# Altium schematic sheet Klok.SchDoc
size A4
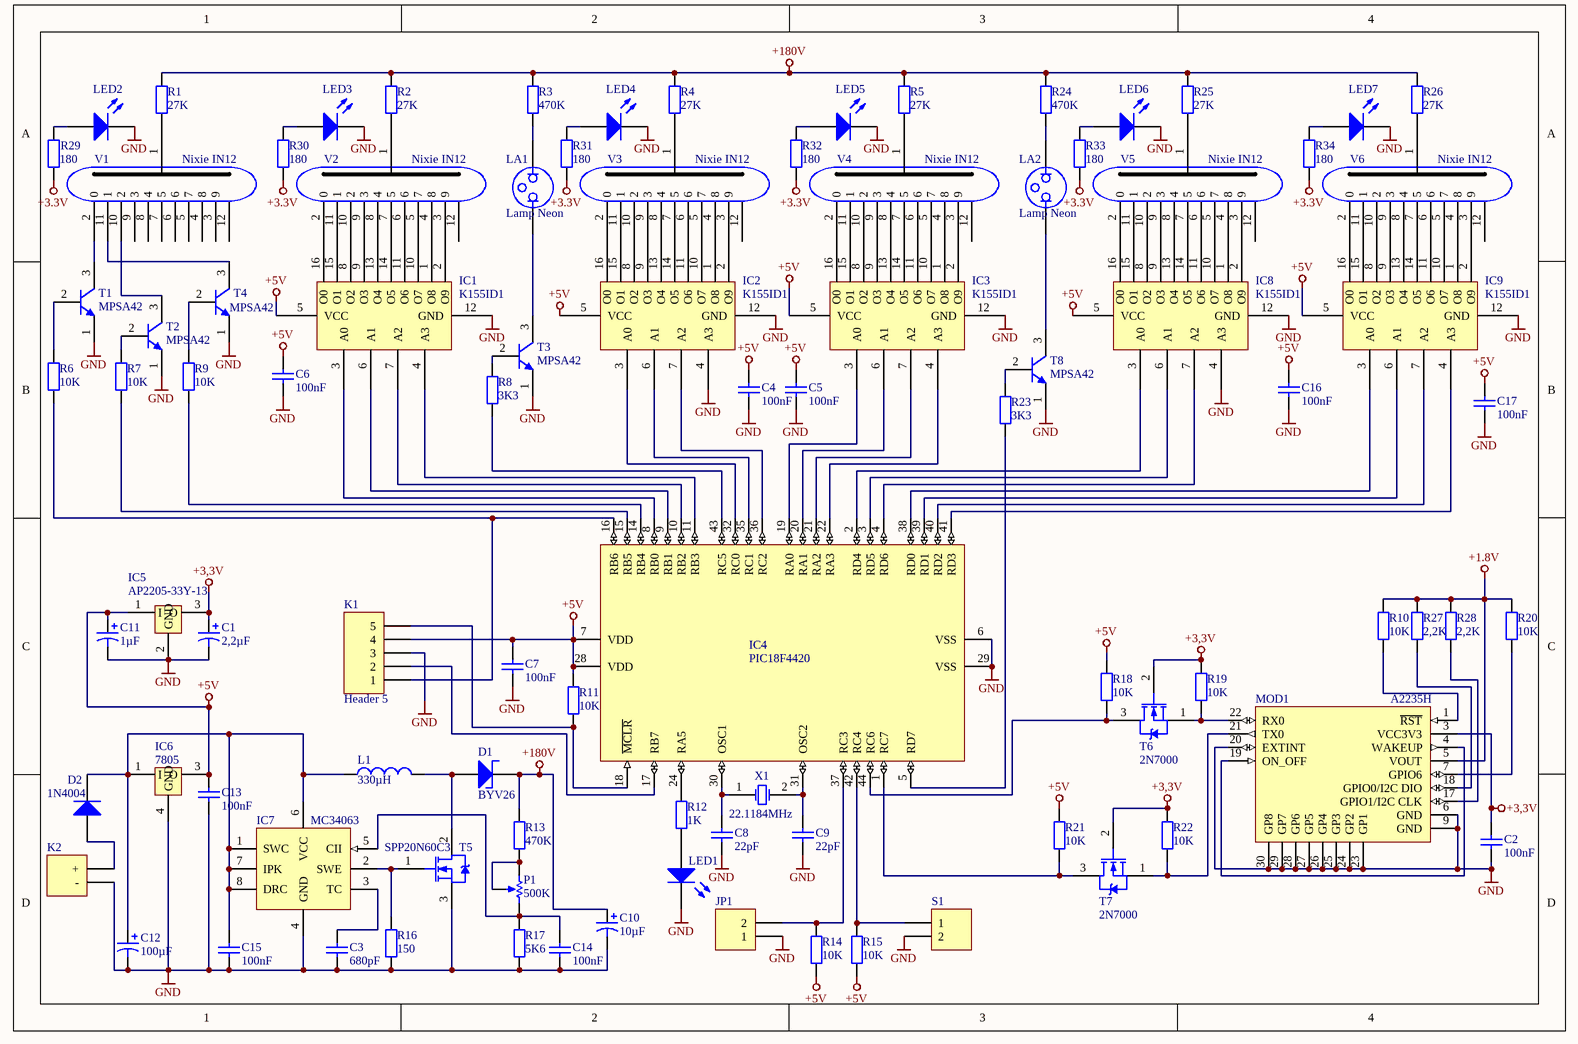
[diagram p0: Klok.SchDoc]

## Parts
C1  value 2,2µF  [ELCO2.2]  (hidden comment: Cap Pol1)
C2  value 100nF  [1206_Capacitor]  (hidden comment: Cap)
C3  value 680pF  [1206_Capacitor]  (hidden comment: Cap)
C4  value 100nF  [1206_Capacitor]  (hidden comment: Cap)
C5  value 100nF  [1206_Capacitor]  (hidden comment: Cap)
C6  value 100nF  [1206_Capacitor]  (hidden comment: Cap)
C7  value 100nF  [1206_Capacitor]  (hidden comment: Cap)
C8  value 22pF  [1206_Capacitor]  (hidden comment: Cap)
C9  value 22pF  [1206_Capacitor]  (hidden comment: Cap)
C10  value 10µF  [ELCO10]  (hidden comment: Cap Pol1)
C11  value 1µF  [ELCO100]  (hidden comment: Cap Pol1)
C12  value 100µF  [ELCO100]  (hidden comment: Cap Pol1)
C13  value 100nF  [1206_Capacitor]  (hidden comment: Cap)
C14  value 100nF  [1206_Capacitor]  (hidden comment: Cap)
C15  value 100nF  [1206_Capacitor]  (hidden comment: Cap)
C16  value 100nF  [1206_Capacitor]  (hidden comment: Cap)
C17  value 100nF  [1206_Capacitor]  (hidden comment: Cap)
D1  BYV26  [Through_Hole]
D2  1N4004  [DO-41]
IC1  K155ID1  [K155ID1]
IC2  K155ID1  [K155ID1]
IC3  K155ID1  [K155ID1]
IC4  PIC18F4420  [PIC18F4420]
IC5  AP2205-33Y-13  [AP2205-33Y-13]
IC6  7805  [7805]
IC7  MC34063  [MC34063]
IC8  K155ID1  [K155ID1]
IC9  K155ID1  [K155ID1]
JP1  Header 2  [HDR1X2]  (value not drawn)
K1  Header 5  [HDR1X5]
K2  Kroonsteen  [KROONSTEEN]  (value not drawn)
L1  value 330µH  [Inductor]  (hidden comment: Inductor)
LA1  Lamp Neon  [Neon_Lamp]
LA2  Lamp Neon  [Neon_Lamp]
LED1  LED0  [1206_LED]  (value not drawn)
LED2  LED0  [1206_LED]  (value not drawn)
LED3  LED0  [1206_LED]  (value not drawn)
LED4  LED0  [1206_LED]  (value not drawn)
LED5  LED0  [1206_LED]  (value not drawn)
LED6  LED0  [1206_LED]  (value not drawn)
LED7  LED0  [1206_LED]  (value not drawn)
MOD1  A2235H  [A2235H]
P1  value 500K  [Pot]  (hidden comment: RPot)
R1  value 27K  [1206_Resistor]  (hidden comment: Res2)
R2  value 27K  [1206_Resistor]  (hidden comment: Res2)
R3  value 470K  [1206_Resistor]  (hidden comment: Res2)
R4  value 27K  [1206_Resistor]  (hidden comment: Res2)
R5  value 27K  [1206_Resistor]  (hidden comment: Res2)
R6  value 10K  [1206_Resistor]  (hidden comment: Res2)
R7  value 10K  [1206_Resistor]  (hidden comment: Res2)
R8  value 3K3  [1206_Resistor]  (hidden comment: Res2)
R9  value 10K  [1206_Resistor]  (hidden comment: Res2)
R10  value 10K  [1206_Resistor]  (hidden comment: Res2)
R11  value 10K  [1206_Resistor]  (hidden comment: Res2)
R12  value 1K  [1206_Resistor]  (hidden comment: Res2)
R13  value 470K  [1206_Resistor]  (hidden comment: Res2)
R14  value 10K  [1206_Resistor]  (hidden comment: Res2)
R15  value 10K  [1206_Resistor]  (hidden comment: Res2)
R16  value 150  [1206_Resistor]  (hidden comment: Res2)
R17  value 5K6  [1206_Resistor]  (hidden comment: Res2)
R18  value 10K  [1206_Resistor]  (hidden comment: Res2)
R19  value 10K  [1206_Resistor]  (hidden comment: Res2)
R20  value 10K  [1206_Resistor]  (hidden comment: Res2)
R21  value 10K  [1206_Resistor]  (hidden comment: Res2)
R22  value 10K  [1206_Resistor]  (hidden comment: Res2)
R23  value 3K3  [1206_Resistor]  (hidden comment: Res2)
R24  value 470K  [1206_Resistor]  (hidden comment: Res2)
R25  value 27K  [1206_Resistor]  (hidden comment: Res2)
R26  value 27K  [1206_Resistor]  (hidden comment: Res2)
R27  value 2,2K  [1206_Resistor]  (hidden comment: Res2)
R28  value 2,2K  [1206_Resistor]  (hidden comment: Res2)
R29  value 180  [1206_Resistor]  (hidden comment: Res2)
R30  value 180  [1206_Resistor]  (hidden comment: Res2)
R31  value 180  [1206_Resistor]  (hidden comment: Res2)
R32  value 180  [1206_Resistor]  (hidden comment: Res2)
R33  value 180  [1206_Resistor]  (hidden comment: Res2)
R34  value 180  [1206_Resistor]  (hidden comment: Res2)
S1  Switch  [HDR1X2]  (value not drawn)
T1  MPSA42  [MPSA42]
T2  MPSA42  [MPSA42]
T3  MPSA42  [MPSA42]
T4  MPSA42  [MPSA42]
T5  SPP20N60C3  [SPP20N60C3]
T6  2N7000  [2N7000]
T7  2N7000  [2N7000]
T8  MPSA42  [MPSA42]
V1  Nixie IN12  [Nixie IN12]
V2  Nixie IN12  [Nixie IN12]
V3  Nixie IN12  [Nixie IN12]
V4  Nixie IN12  [Nixie IN12]
V5  Nixie IN12  [Nixie IN12]
V6  Nixie IN12  [Nixie IN12]
X1  22.1184MHz  [XTAL - duplicate]

## Nets
+1.8V: MOD1.5(VOUT) R10.2 R20.2 R27.2 R28.2
+3,3V: C1.1 C2.2 IC5.3(O) MOD1.3(VCC3V3) R19.2 R22.2 T6.2(G) T7.2(G)
+3.3V: R29.1 R30.1 R31.1 R32.1 R33.1 R34.1
+5V: C4.2 C5.2 C6.2 C7.2 C11.1 C13.2 C16.2 C17.2 IC1.5(VCC) IC2.5(VCC) IC3.5(VCC) IC4.7(VDD) IC4.28(VDD) IC5.1(I) IC6.3(O) IC8.5(VCC) IC9.5(VCC) K1.4 R11.2 R14.1 R15.1 R18.2 R21.2
+180V: C10.1 D1.2(K) R1.2 R2.2 R3.2 R4.2 R5.2 R13.2 R24.2 R25.2 R26.2
GND: C1.2 C2.1 C3.1 C4.1 C5.1 C6.1 C7.1 C8.1 C9.1 C10.2 C11.2 C12.2 C13.1 C14.1 C15.1 C16.1 C17.1 IC1.12(GND) IC2.4(A3) IC2.12(GND) IC3.12(GND) IC4.6(VSS) IC4.29(VSS) IC5.2(GND) IC6.4(GND) IC7.4(GND) IC8.4(A3) IC8.12(GND) IC9.12(GND) JP1.1 K1.3 K2.1(-) LED1.2(K) LED2.2(K) LED3.2(K) LED4.2(K) LED5.2(K) LED6.2(K) LED7.2(K) MOD1.6(GND) MOD1.9(GND) MOD1.20(EXTINT) MOD1.23(GP1) MOD1.24(GP2) MOD1.25(GP3) MOD1.26(GP4) MOD1.27(GP5) MOD1.28(GP6) MOD1.29(GP7) MOD1.30(GP8) R16.1 R17.1 S1.2 T1.1(E) T2.1(E) T3.1(E) T4.1(E) T5.3(SOURCE) T8.1(E)
NetC3_2: C3.2 IC7.3(TC)
NetC8_2: C8.2 IC4.30(OSC1) X1.1(OSC1)
NetC9_2: C9.2 IC4.31(OSC2) X1.2(OSC2)
NetC12_1: C12.1 C15.2 D2.2(K) IC6.1(I) IC7.1(SWC) IC7.6(VCC) IC7.7(IPK) IC7.8(DRC) L1.1
NetC14_2: C14.2 IC7.5(CII) P1.2(BOT) R17.2
NetD1_1: D1.1(A) L1.2 T5.2(DRAIN)
NetD2_1: D2.1(A) K2.2(+)
NetIC1_1: IC1.1(O8) V2.4(8)
NetIC1_2: IC1.2(O9) V2.3(9)
NetIC1_3: IC1.3(A0) IC4.8(RB0)
NetIC1_4: IC1.4(A3) IC4.11(RB3)
NetIC1_6: IC1.6(A1) IC4.9(RB1)
NetIC1_7: IC1.7(A2) IC4.10(RB2)
NetIC1_8: IC1.8(O2) V2.10(2)
NetIC1_9: IC1.9(O3) V2.9(3)
NetIC1_10: IC1.10(O7) V2.5(7)
NetIC1_11: IC1.11(O6) V2.6
NetIC1_13: IC1.13(O4) V2.8(4)
NetIC1_14: IC1.14(O5) V2.7(5)
NetIC1_15: IC1.15(O1) V2.11(1)
NetIC1_16: IC1.16(O0) V2.2(0)
NetIC2_1: IC2.1(O8) V3.4(8)
NetIC2_2: IC2.2(O9) V3.3(9)
NetIC2_3: IC2.3(A0) IC4.32(RC0)
NetIC2_6: IC2.6(A1) IC4.35(RC1)
NetIC2_7: IC2.7(A2) IC4.36(RC2)
NetIC2_8: IC2.8(O2) V3.10(2)
NetIC2_9: IC2.9(O3) V3.9(3)
NetIC2_10: IC2.10(O7) V3.5(7)
NetIC2_11: IC2.11(O6) V3.6
NetIC2_13: IC2.13(O4) V3.8(4)
NetIC2_14: IC2.14(O5) V3.7(5)
NetIC2_15: IC2.15(O1) V3.11(1)
NetIC2_16: IC2.16(O0) V3.2(0)
NetIC3_1: IC3.1(O8) V4.4(8)
NetIC3_2: IC3.2(O9) V4.3(9)
NetIC3_3: IC3.3(A0) IC4.19(RA0)
NetIC3_4: IC3.4(A3) IC4.22(RA3)
NetIC3_6: IC3.6(A1) IC4.20(RA1)
NetIC3_7: IC3.7(A2) IC4.21(RA2)
NetIC3_8: IC3.8(O2) V4.10(2)
NetIC3_9: IC3.9(O3) V4.9(3)
NetIC3_10: IC3.10(O7) V4.5(7)
NetIC3_11: IC3.11(O6) V4.6
NetIC3_13: IC3.13(O4) V4.8(4)
NetIC3_14: IC3.14(O5) V4.7(5)
NetIC3_15: IC3.15(O1) V4.11(1)
NetIC3_16: IC3.16(O0) V4.2(0)
NetIC4_1: IC4.1(RC7) R21.1 T7.3(D)
NetIC4_2: IC4.2(RD4) IC8.3(A0)
NetIC4_3: IC4.3(RD5) IC8.6(A1)
NetIC4_4: IC4.4(RD6) IC8.7(A2)
NetIC4_5: IC4.5(RD7) R23.1
NetIC4_14: IC4.14(RB4) R9.1
NetIC4_15: IC4.15(RB5) R7.1
NetIC4_16: IC4.16(RB6) K1.1 R6.1
NetIC4_17: IC4.17(RB7) K1.2
NetIC4_18: IC4.18(~{MCLR}) K1.5 R11.1
NetIC4_24: IC4.24(RA5) R12.2
NetIC4_37: IC4.37(RC3) JP1.2 R14.2
NetIC4_38: IC4.38(RD0) IC9.3(A0)
NetIC4_39: IC4.39(RD1) IC9.6(A1)
NetIC4_40: IC4.40(RD2) IC9.7(A2)
NetIC4_41: IC4.41(RD3) IC9.4(A3)
NetIC4_42: IC4.42(RC4) R15.2 S1.1
NetIC4_43: IC4.43(RC5) R8.1
NetIC4_44: IC4.44(RC6) R18.1 T6.3(D)
NetIC7_2: IC7.2(SWE) R16.2 T5.1(GATE)
NetIC8_1: IC8.1(O8) V5.4(8)
NetIC8_2: IC8.2(O9) V5.3(9)
NetIC8_8: IC8.8(O2) V5.10(2)
NetIC8_9: IC8.9(O3) V5.9(3)
NetIC8_10: IC8.10(O7) V5.5(7)
NetIC8_11: IC8.11(O6) V5.6
NetIC8_13: IC8.13(O4) V5.8(4)
NetIC8_14: IC8.14(O5) V5.7(5)
NetIC8_15: IC8.15(O1) V5.11(1)
NetIC8_16: IC8.16(O0) V5.2(0)
NetIC9_1: IC9.1(O8) V6.4(8)
NetIC9_2: IC9.2(O9) V6.3(9)
NetIC9_8: IC9.8(O2) V6.10(2)
NetIC9_9: IC9.9(O3) V6.9(3)
NetIC9_10: IC9.10(O7) V6.5(7)
NetIC9_11: IC9.11(O6) V6.6
NetIC9_13: IC9.13(O4) V6.8(4)
NetIC9_14: IC9.14(O5) V6.7(5)
NetIC9_15: IC9.15(O1) V6.11(1)
NetIC9_16: IC9.16(O0) V6.2(0)
NetLA1_1: LA1.1 T3.3(C)
NetLA1_2: LA1.2 R3.1
NetLA2_1: LA2.1 T8.3(C)
NetLA2_2: LA2.2 R24.1
NetLED1_1: LED1.1(A) R12.1
NetLED2_1: LED2.1(A) R29.2
NetLED3_1: LED3.1(A) R30.2
NetLED4_1: LED4.1(A) R31.2
NetLED5_1: LED5.1(A) R32.2
NetLED6_1: LED6.1(A) R33.2
NetLED7_1: LED7.1(A) R34.2
NetMOD1_1: MOD1.1(~{RST}) R10.1
NetMOD1_4: MOD1.4(WAKEUP) MOD1.19(ON_OFF)
NetMOD1_7: MOD1.7(GPIO6) R20.1
NetMOD1_17: MOD1.17(GPIO1/I2C_CLK) R28.1
NetMOD1_18: MOD1.18(GPIO0/I2C_DIO) R27.1
NetMOD1_21: MOD1.21(TX0) R22.1 T7.1(S)
NetMOD1_22: MOD1.22(RX0) R19.1 T6.1(S)
NetP1_1: P1.1(TOP) P1.3(TAP) R13.1
NetR1_1: R1.1 V1.1
NetR2_1: R2.1 V2.1
NetR4_1: R4.1 V3.1
NetR5_1: R5.1 V4.1
NetR6_2: R6.2 T1.2(B)
NetR7_2: R7.2 T2.2(B)
NetR8_2: R8.2 T3.2(B)
NetR9_2: R9.2 T4.2(B)
NetR23_2: R23.2 T8.2(B)
NetR25_1: R25.1 V5.1
NetR26_1: R26.1 V6.1
NetT1_3: T1.3(C) V1.2(0)
NetT2_3: T2.3(C) V1.10(2)
NetT4_3: T4.3(C) V1.11(1)

Not connected (* = marked no-connect by the designer): V1 3(9) 4(8) 5(7) 6 7(5) 8(4) 9(3) 12(25); V2 12(25); V3 12(25); V4 12(25); V5 12(25); V6 12(25)

## Library data of the parts
C1 C10-C12 = Cap Pol1: Polarized Capacitor (Radial); Published: 8-Jun-2000; LatestRevisionDate: 17-Jul-2002; LatestRevisionNote: Re-released for DXP Platform.; PackageReference: RB7.6-15; Publisher: Altium Limited; PackageDescription: Polarized Capacitor (Radial); 2 Leads
C2-C9 C13-C17 = Cap: Capacitor; Published: 8-Jun-2000; LatestRevisionDate: 17-Jul-2002; LatestRevisionNote: Re-released for DXP Platform.; PackageReference: RAD-0.3; Publisher: Altium Limited; PackageDescription: Radial Cap, Thru-Hole; 2 Leads; 0.3 in Pin Spacing
D2 = Diode 1N4004: 1 Amp General Purpose Rectifier; Published: 8-Jun-2000; LatestRevisionDate: 17-Jul-2002; LatestRevisionNote: Re-released for DXP Platform.; DatasheetVersion: 1998; PackageVersion: Aug-1999; PackageReference: DO-41; Publisher: Altium Limited; PackageDescription: Diode, Axial; Body 5.2 x 2.7 mm (LxDia. max), Lead Dia. 0.86 mm (max); Code_JEDEC: DO-204-AL; ComponentLink1Description: Manufacturer Link; ComponentLink1URL: http://www.fairchildsemi.com/; ComponentLink2Description: Datasheet; ComponentLink2URL: http://www.fairchildsemi.com/ds/1N%2F1N4001.pdf
JP1 K2 S1 = Header 2: Header, 2-Pin; LatestRevisionDate: 17-Jul-2002; LatestRevisionNote: Re-released for DXP Platform.; Publisher: Altium Limited
K1 = Header 5: Header, 5-Pin; LatestRevisionDate: 17-Jul-2002; LatestRevisionNote: Re-released for DXP Platform.; Publisher: Altium Limited
L1 = Inductor: Code_IEC: 1005; Published: 8-Jun-2000; LatestRevisionDate: 29-May-2009; LatestRevisionNote: IPC-7351 Footprint Added.; PackageReference: 0402-A; Publisher: Altium Limited; PackageDescription: Chip Inductor; Code_JEITA: 0402
LA1 LA2 = Lamp Neon: Neon Lamp; Published: 24-Mar-1999; LatestRevisionDate: 17-Jul-2002; LatestRevisionNote: Re-released for DXP Platform.; PackageReference: PIN2; Publisher: Altium Limited
LED1-LED7 = LED0: Typical INFRARED GaAs LED; Published: 8-Jun-2000; LatestRevisionDate: 08-Jul-2005; LatestRevisionNote: Mech Layer 1 removed.; PackageReference: LED-0; Publisher: Altium Limited; PackageDescription: LED; 2 Leads
P1 = RPot: Potentiometer; Sim Note: Enter the Resistance value and the set point into parameter fields.; Set Position: 0.5; Published: 8-Jun-2000; LatestRevisionDate: 17-Jul-2002; LatestRevisionNote: Re-released for DXP Platform.; PackageReference: VR5; Publisher: Altium Limited; PackageDescription: Variable Resistor, Thru-Hole; 3 Leads
R1-R34 = Res2: Resistor; Published: 8-Jun-2000; LatestRevisionDate: 17-Jul-2002; LatestRevisionNote: Re-released for DXP Platform.; PackageReference: AXIAL-0.4; Publisher: Altium Limited; PackageDescription: Axial Device, Thru-Hole; 2 Leads; 0.4 in Pin Spacing
X1 = XTAL: Crystal Oscillator; Published: 8-Jun-2000; LatestRevisionDate: 17-Jul-2002; LatestRevisionNote: Re-released for DXP Platform.; PackageReference: R38; Publisher: Altium Limited; PackageDescription: Crystal, Thru-Hole; 2 Leads; Body 3.1 x 8.2 mm (Dia.xH)